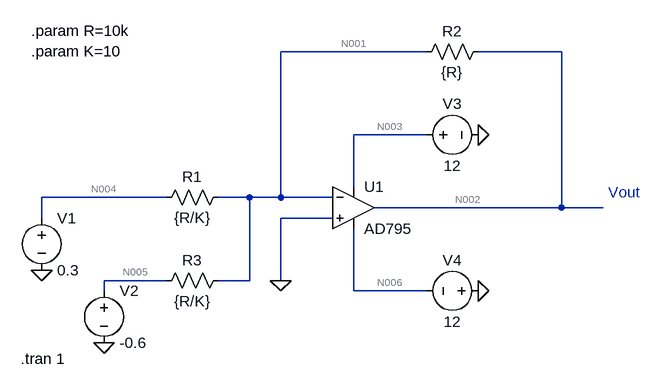
[diagram p0: schematic t1.asc]
t1.asc, the LTspice schematic file:
Version 4.1
SHEET 1 880 680
WIRE 336 -80 112 -80
WIRE 544 -80 416 -80
WIRE 336 48 224 48
WIRE 224 128 224 48
WIRE -64 144 -256 144
WIRE 64 144 16 144
WIRE 112 144 112 -80
WIRE 112 144 64 144
WIRE 192 144 112 144
WIRE 544 160 544 -80
WIRE 544 160 256 160
WIRE 608 160 544 160
WIRE -256 176 -256 144
WIRE 192 176 112 176
WIRE -64 272 -160 272
WIRE 64 272 64 144
WIRE 64 272 16 272
WIRE 112 272 112 176
WIRE -160 288 -160 272
WIRE 224 288 224 192
WIRE 336 288 224 288
FLAG -256 256 0
FLAG -160 368 0
FLAG 112 272 0
FLAG 416 48 0
FLAG 416 288 0
DATAFLAG 592 160 ""
SYMBOL OpAmps\\AD795 224 96 R0
SYMATTR InstName U1
SYMBOL res 32 128 R90
WINDOW 0 0 56 VBottom 2
WINDOW 3 32 56 VTop 2
SYMATTR InstName R1
SYMATTR Value {R/K}
SYMBOL res 432 -96 R90
WINDOW 0 0 56 VBottom 2
WINDOW 3 32 56 VTop 2
SYMATTR InstName R2
SYMATTR Value {R}
SYMBOL res 32 256 R90
WINDOW 0 0 56 VBottom 2
WINDOW 3 32 56 VTop 2
SYMATTR InstName R3
SYMATTR Value {R/K}
SYMBOL voltage -256 160 R0
WINDOW 123 0 0 Left 0
WINDOW 39 0 0 Left 0
SYMATTR InstName V1
SYMATTR Value 0.3
SYMBOL voltage -160 272 R0
WINDOW 123 0 0 Left 0
WINDOW 39 0 0 Left 0
SYMATTR InstName V2
SYMATTR Value -0.6
SYMBOL voltage 320 48 R270
WINDOW 0 32 56 VTop 2
WINDOW 3 -32 56 VBottom 2
SYMATTR InstName V3
SYMATTR Value 12
SYMBOL voltage 432 288 R90
WINDOW 0 -32 56 VBottom 2
WINDOW 3 32 56 VTop 2
SYMATTR InstName V4
SYMATTR Value 12
TEXT 616 136 Left 2 ;Vout
TEXT -272 -112 Left 2 !.param R=10k\n.param K=10
TEXT -288 392 Left 2 !.tran 1

The netlist it stands for:
* t1.asc
X§U1 0 N001 N003 N006 N002 AD795  ; pins In+ In- V+ V- OUT
R1 N001 N004 {R/K}
R2 N002 N001 {R}
R3 N001 N005 {R/K}
V1 N004 0 0.3
V2 N005 0 -0.6
V3 N003 0 12
V4 0 N006 12
* Vout
.param R=10k
.param K=10
.tran 1
.lib ADI1.lib
.backanno
.end

* Results of the author's LTspice run, read from the files saved beside the schematic
* Operating Point, zero values left out:
*   V(n001) = -2.786 µV
*   V(n002) = 3 V
*   V(n003) = 12 V
*   V(n004) = 300 mV
*   V(n005) = -600 mV
*   V(n006) = -12 V
*   I(R1) = -300 µA
*   I(R2) = 300 µA
*   I(R3) = 600 µA
*   I(V1) = -300 µA
*   I(V2) = 600 µA
*   I(V3) = -1.41 mA
*   I(V4) = -1.11 mA
*   Ix(u1:3) = 1.41 mA
*   Ix(u1:4) = -1.11 mA
*   Ix(u1:5) = -300 µA